# EAGLE design Swagelock controller (EAGLE 7.6.0)

## Sheet 1 of 2
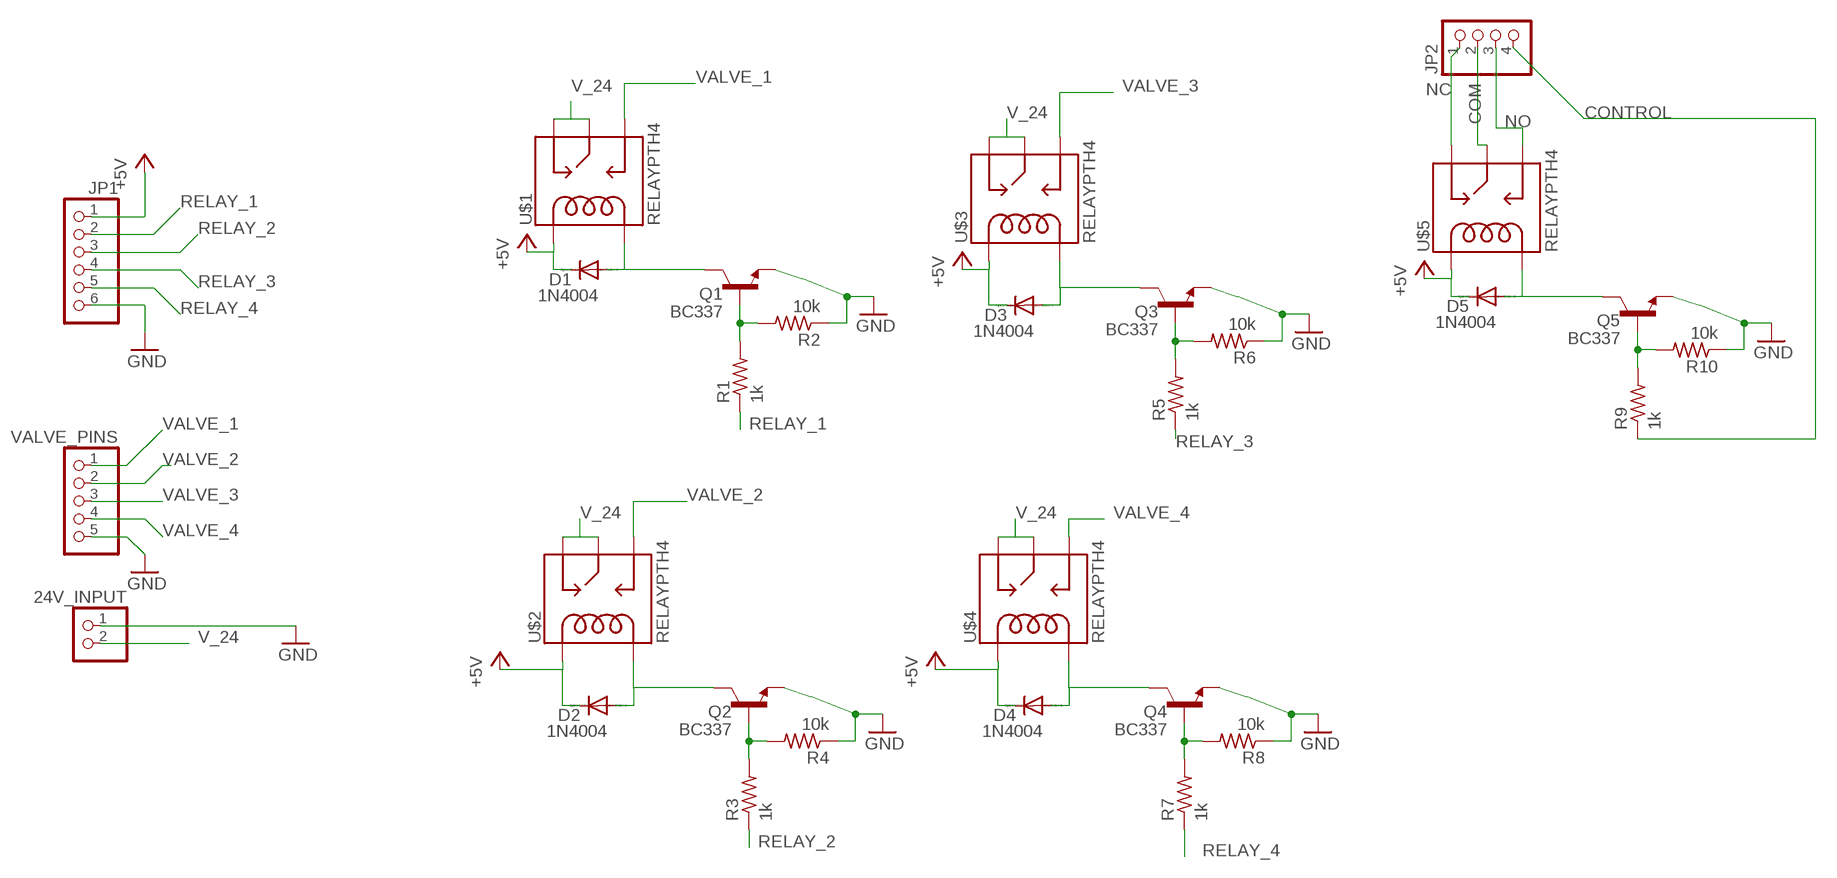
[diagram p0: schematic, sheet 1]

### Parts
24V_INPUT  PINHD-1X2  [1X02]
D1  1N4004  [DO41-10]
D2  1N4004  [DO41-10]
D3  1N4004  [DO41-10]
D4  1N4004  [DO41-10]
D5  1N4004  [DO41-10]
JP1  PINHD-1X6  [1X06]
JP2  PINHD-1X4  [1X04]
Q1  BC337  [TO92]
Q2  BC337  [TO92]
Q3  BC337  [TO92]
Q4  BC337  [TO92]
Q5  BC337  [TO92]
R1  1k  R-US_0204/5  [0204/5]
R2  10k  R-US_0204/5  [0204/5]
R3  1k  R-US_0204/5  [0204/5]
R4  10k  R-US_0204/5  [0204/5]
R5  1k  R-US_0204/5  [0204/5]
R6  10k  R-US_0204/5  [0204/5]
R7  1k  R-US_0204/5  [0204/5]
R8  10k  R-US_0204/5  [0204/5]
R9  1k  R-US_0204/5  [0204/5]
R10  10k  R-US_0204/5  [0204/5]
U$1  RELAYPTH4  [RELAY-JZC]
U$2  RELAYPTH4  [RELAY-JZC]
U$3  RELAYPTH4  [RELAY-JZC]
U$4  RELAYPTH4  [RELAY-JZC]
U$5  RELAYPTH4  [RELAY-JZC]
VALVE_PINS  PINHD-1X5  [1X05]

### Nets
+5V: D1.C D2.C D3.C D4.C D5.C JP1.1 U$1.5(COIL1) U$2.5(COIL1) U$3.5(COIL1) U$4.5(COIL1) U$5.5(COIL1)
COM: JP2.2 U$5.4(MAIN)
CONTROL: JP2.4 R9.1
GND: 24V_INPUT.1 JP1.6 Q1.1(E) Q2.1(E) Q3.1(E) Q4.1(E) Q5.1(E) R2.1 R4.1 R6.1 R8.1 R10.1 VALVE_PINS.5
N$1: Q1.2(B) R1.2 R2.2
N$2: D1.A Q1.3(C) U$1.1(COIL2)
N$3: Q2.2(B) R3.2 R4.2
N$4: D2.A Q2.3(C) U$2.1(COIL2)
N$5: Q3.2(B) R5.2 R6.2
N$6: D3.A Q3.3(C) U$3.1(COIL2)
N$7: Q4.2(B) R7.2 R8.2
N$8: D4.A Q4.3(C) U$4.1(COIL2)
N$9: Q5.2(B) R9.2 R10.2
N$10: D5.A Q5.3(C) U$5.1(COIL2)
NC: JP2.1 U$5.2(NC)
NO: JP2.3 U$5.3(NO)
RELAY_1: JP1.2 R1.1
RELAY_2: JP1.3 R3.1
RELAY_3: JP1.4 R5.1
RELAY_4: JP1.5 R7.1
V_24: 24V_INPUT.2 U$1.2(NC) U$1.4(MAIN) U$2.2(NC) U$2.4(MAIN) U$3.2(NC) U$3.4(MAIN) U$4.2(NC) U$4.4(MAIN)
VALVE_1: U$1.3(NO) VALVE_PINS.1
VALVE_2: U$2.3(NO) VALVE_PINS.2
VALVE_3: U$3.3(NO) VALVE_PINS.3
VALVE_4: U$4.3(NO) VALVE_PINS.4

## Sheet 2 of 2

## Library data of the parts
24V_INPUT = pinhead:PINHD-1X2: PIN HEADER
D1-D5 = diode:1N4004: DIODE general purpose rectifier, 1 A
JP1 = pinhead:PINHD-1X6: PIN HEADER
JP2 = pinhead:PINHD-1X4: PIN HEADER
Q1-Q5 = transistor-npn:BC337*: NPN Transistor
R1-R10 = resistor:R-US_: RESISTOR, American symbol
U$1-U$5 = SparkFun-Electromechanical:RELAY: SPDT relay (COM-00101)
VALVE_PINS = pinhead:PINHD-1X5: PIN HEADER

## Board
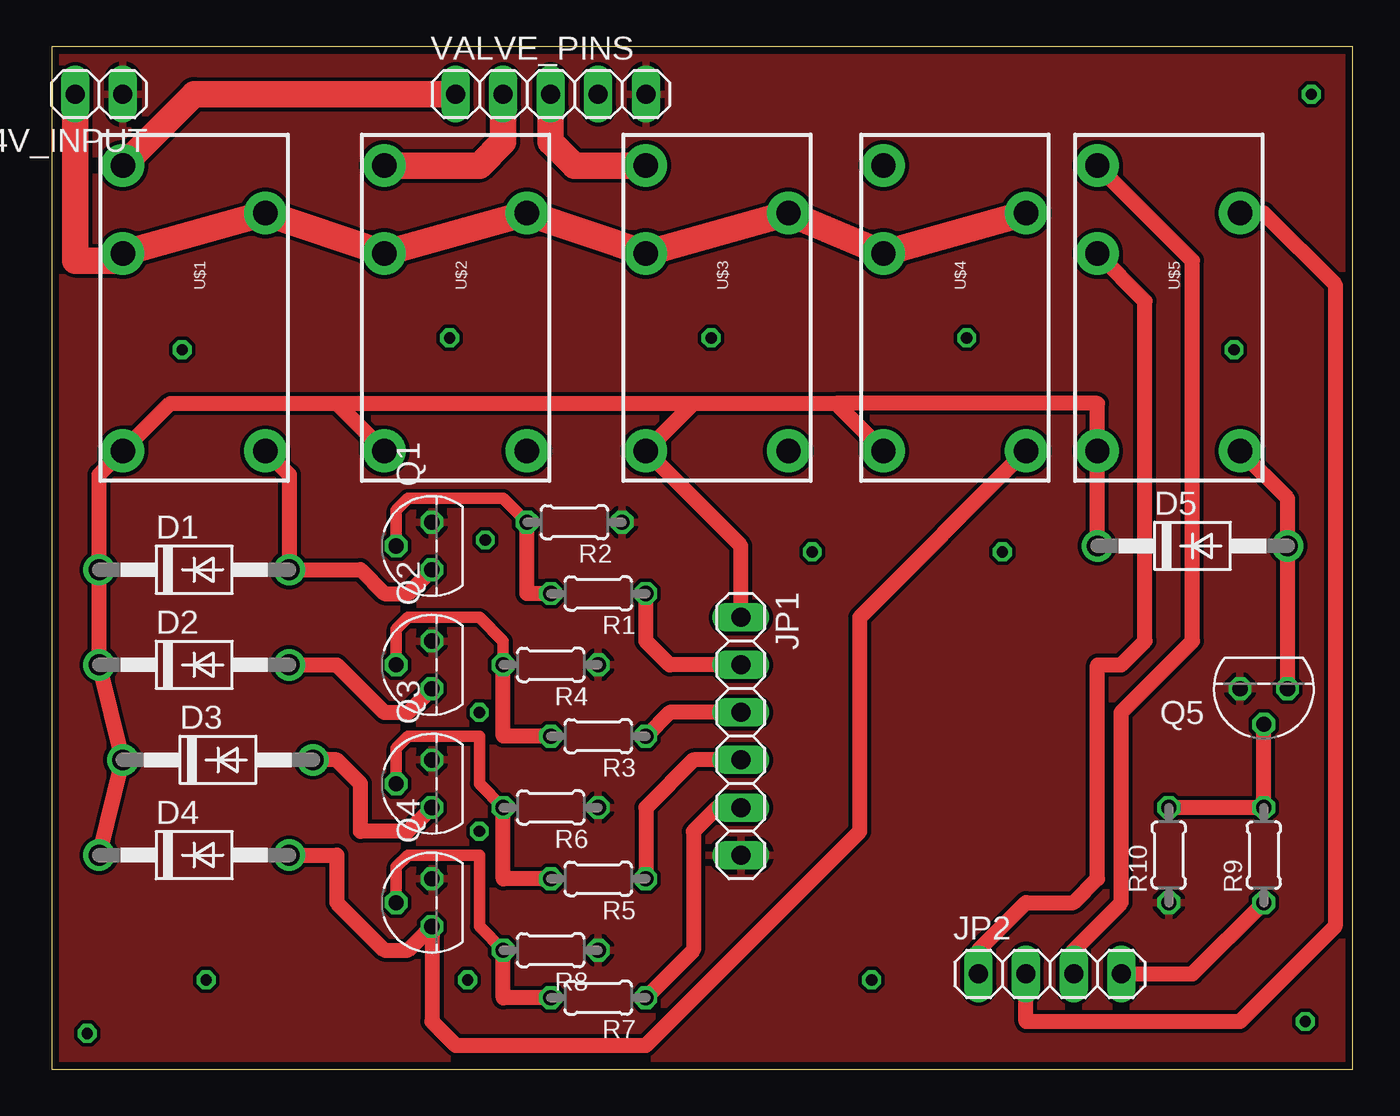
[diagram p1: board, top side]
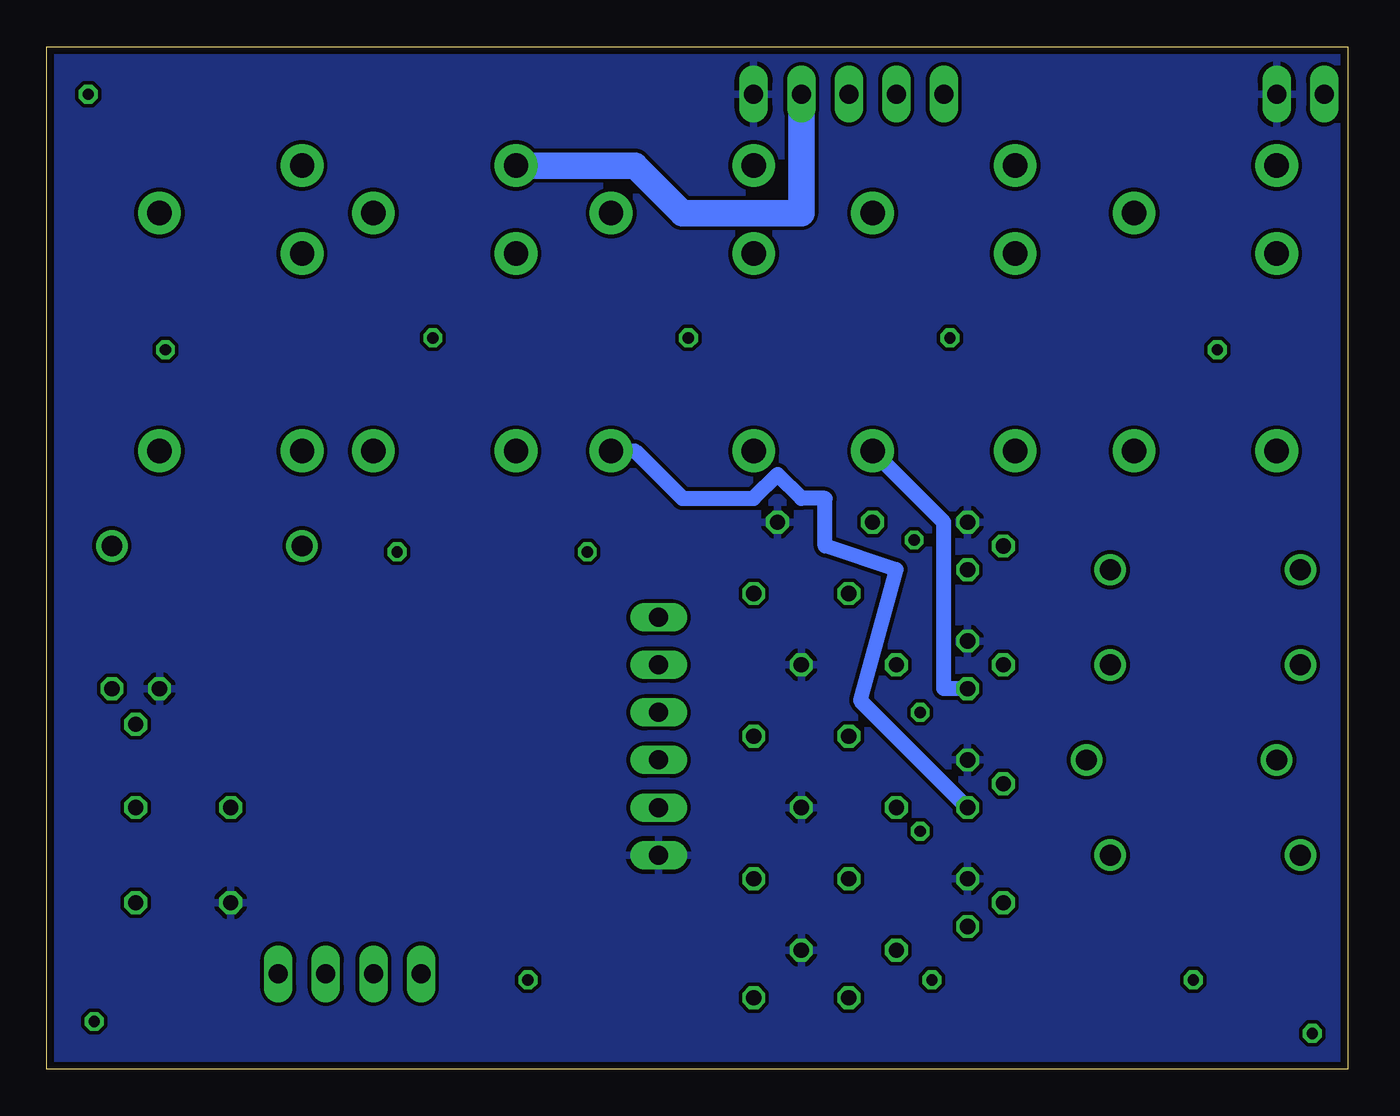
[diagram p2: board, bottom side, seen from below]

Size 69.52 x 54.6 mm. Coordinates in mm from the lower left corner, seen from the top.
Outline: 0,0 69.52,0 69.52,54.6 0,54.6 0,0
Copper layers (1*16): Top 0.0178mm / dielectric 59mil / Bottom 0.0178mm
Design rules "epl-lpkf": minimum track width 8mil, minimum drill 0.35mm, track to track 8mil, track to pad 8mil, pad to pad 8mil, via to via 8mil, smd to smd 8mil, copper to edge 15mil, drill to drill 15mil, minimum pad ring 8mil, minimum via ring 8mil, stop-mask expansion 3mil, vias tented up to drill 0mil, thermal gap 10mil

### Footprints (pad centres in the part's own frame; a part is rotated, then mirrored left to right if it is on the bottom)
1X02 = drill 1.016 long: 1 -1.27,0; 2 1.27,0
DO41-10 = drill 1.118: A 5.08,0; C -5.08,0
1X06 = drill 1.016 long: 1 -6.35,0; 2 -3.81,0; 3 -1.27,0; 4 1.27,0; 5 3.81,0; 6 6.35,0
1X04 = drill 1.016 long: 1 -3.81,0; 2 -1.27,0; 3 1.27,0; 4 3.81,0
TO92 = drill 0.813 octagon: 1 1.27,0; 2 0,1.905; 3 -1.27,0
0204/5 = drill 0.813 octagon: 1 -2.54,0; 2 2.54,0
RELAY-JZC = drill 1.3 pad 2.286: 1 3.81,-8.89; 2 -3.81,1.651; 3 -3.81,6.35; 4 3.81,3.81; 5 -3.81,-8.89
1X05 = drill 1.016 long: 1 -5.08,0; 2 -2.54,0; 3 0,0; 4 2.54,0; 5 5.08,0

### Placement (x,y rotation side)
24V_INPUT  2.54,52.07 180 top
D1  7.62,26.67 0 top
D2  7.62,21.59 0 top
D3  8.89,16.51 0 top
D4  7.62,11.43 0 top
D5  60.96,27.94 0 top
JP1  36.83,17.78 270 top
JP2  53.34,5.08 0 top
Q1  20.32,27.94 90 top
Q2  20.32,21.59 90 top
Q3  20.32,15.24 90 top
Q4  20.32,8.89 90 top
Q5  64.77,20.32 180 top
R1  29.21,25.4 180 top
R2  27.94,29.21 180 top
R3  29.21,17.78 180 top
R4  26.67,21.59 180 top
R5  29.21,10.16 180 top
R6  26.67,13.97 180 top
R7  29.21,3.81 180 top
R8  26.67,6.35 180 top
R9  64.77,11.43 90 top
R10  59.69,11.43 90 top
U$1  7.62,41.91 0 top
U$2  21.59,41.91 0 top
U$3  35.56,41.91 0 top
U$4  48.26,41.91 0 top
U$5  59.69,41.91 0 top
VALVE_PINS  26.67,52.07 0 top

### Tracks (layer width: path | path; a pad name or v marks a point on that pad's centre or on a via)
+5V
  Top 0.813: D4.C D3.C D2.C D1.C 2.54,31.75 U$1.5 6.35,35.56 15.24,35.56 | 15.24,35.56 34.29,35.56 | 34.29,35.56 41.91,35.56 | 41.91,35.56 U$4.5 | U$2.5 15.24,35.56 | 34.29,35.56 U$3.5 36.83,27.94 JP1.1 | 41.91,35.56 55.88,35.56 U$5.5 D5.C
COM
  Top 0.813: U$5.4 64.77,45.72 68.58,41.91 68.58,7.62 63.5,2.54 52.07,2.54 JP2.2
CONTROL
  Top 0.813: JP2.4 60.96,5.08 R9.1
GND
  pour Top: 0,54.61 69.85,54.61 69.85,0 0,0
  pour Bottom: 0,54.61 0,0 69.85,0 69.85,54.61
N$1
  Top 0.61: Q1.2 18.41,29.84 19.05,30.48 24.13,30.48 R2.2
  Top 0.813: R1.2 25.4,25.4 R2.2
N$2
  Top 0.813: U$1.1 12.7,31.75 D1.A 16.51,26.67 17.78,25.4 19.05,25.4 Q1.3
N$3
  Top 0.61: Q2.2 18.41,23.5 19.05,24.13 22.86,24.13 24.13,22.86 R4.2
  Top 0.813: R3.2 24.13,17.78 R4.2
N$4
  Top 0.813: D2.A 15.24,21.59 17.78,19.05 19.05,19.05 Q2.3
  Bottom 0.813: Q2.3 21.59,20.32 21.59,29.21 U$2.1
N$5
  Top 0.61: Q3.2 18.41,17.14 19.05,17.78 22.86,17.78 22.86,15.24 R6.2
  Top 0.813: R5.2 24.13,10.16 R6.2
N$6
  Top 0.813: Q3.3 19.05,12.7 16.51,12.7 16.51,15.24 15.24,16.51 D3.A
  Bottom 0.813: Q3.3 26.04,19.68 24.13,26.67 27.94,27.94 27.94,30.48 29.21,30.48 30.48,31.75 31.75,30.48 35.56,30.48 38.1,33.02 U$3.1
N$7
  Top 0.61: Q4.2 18.41,10.79 19.05,11.43 22.86,11.43 22.86,7.62 R8.2
  Top 0.813: R7.2 24.13,3.81 R8.2
N$8
  Top 0.813: D4.A 15.24,11.43 15.24,8.89 17.78,6.35 19.05,6.35 Q4.3 20.32,2.54 21.59,1.27 31.75,1.27 43.18,12.7 43.18,24.13 U$4.1
N$9
  Top 0.813: Q5.2 R9.2 R10.2
N$10
  Top 0.813: Q5.3 D5.A 66.04,30.48 U$5.1
N$11  (via drill 0.6)
  other vias: 22.86,19.05
N$12  (via drill 0.6)
  other vias: 22.86,12.7
N$13  (via drill 0.6)
  other vias: 23.18,28.26
N$14  (via drill 0.6)
  other vias: 22.23,4.76
N$15  (via drill 0.6)
  other vias: 8.26,4.76
N$16  (via drill 0.6)
  other vias: 40.64,27.62
N$17  (via drill 0.6)
  other vias: 50.8,27.62
N$18  (via drill 0.6)
  other vias: 43.81,4.76
N$19  (via drill 0.6)
  other vias: 35.24,39.05
N$20  (via drill 0.6)
  other vias: 21.27,39.05
N$21  (via drill 0.6)
  other vias: 6.99,38.42
N$22  (via drill 0.6)
  other vias: 48.9,39.05
N$23  (via drill 0.6)
  other vias: 63.18,38.42
N$24  (via drill 0.6)
  other vias: 67.31,52.07
N$25  (via drill 0.6)
  other vias: 1.91,1.91
N$26  (via drill 0.6)
  other vias: 66.99,2.54
NC
  Top 0.813: JP2.1 49.53,6.35 52.07,8.89 54.61,8.89 55.88,10.16 55.88,21.59 57.15,21.59 58.42,22.86 58.42,41.02 U$5.2
NO
  Top 0.813: JP2.3 54.61,6.35 57.15,8.89 57.15,19.05 60.96,22.86 60.96,43.18 U$5.3
RELAY_1
  Top 0.813: JP1.2 33.02,21.59 31.75,22.86 R1.1
RELAY_2
  Top 0.813: JP1.3 33.02,19.05 R3.1
RELAY_3
  Top 0.813: JP1.4 34.29,16.51 31.75,13.97 R5.1
RELAY_4
  Top 0.813: JP1.5 35.56,13.97 34.29,12.7 34.29,6.35 R7.1
V_24
  Top 1.422: U$4.4 U$4.2 U$3.4 U$3.2 U$2.4 U$2.2 U$1.4 U$1.2 3.43,43.18 1.27,43.18 24V_INPUT.2
VALVE_1
  Top 1.422: U$1.3 7.62,52.07 VALVE_PINS.1
VALVE_2
  Top 1.422: U$2.3 22.86,48.26 24.13,49.53 VALVE_PINS.2
VALVE_3
  Top 1.422: U$3.3 27.94,48.26 26.67,49.53 VALVE_PINS.3
VALVE_4
  Bottom 1.422: VALVE_PINS.4 29.21,45.72 35.56,45.72 38.1,48.26 U$4.3